# Altium schematic sheet OMD_30G_IMU.SchDoc
size A4; Organization: Altium Limited; Address1: L3, 12a Rodborough Rd; Address2: Frenchs Forest; Address3: NSW; Address4: Australia 2086
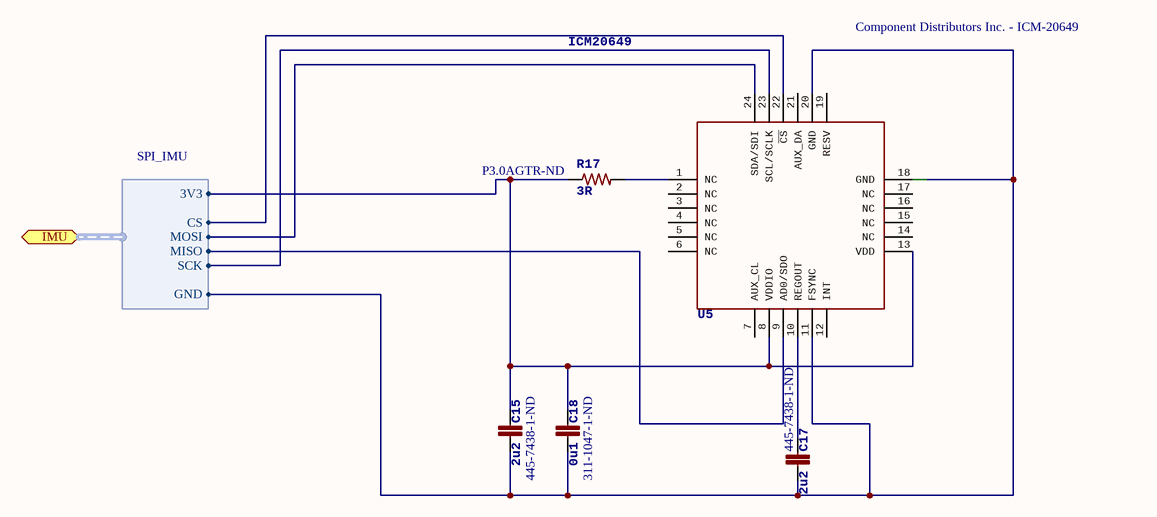
[diagram p0: OMD_30G_IMU.SchDoc]

## Parts
C15  2u2  Supplier Part Number 1: 445-7438-1-ND  [0603-CAP]
C17  2u2  Supplier Part Number 1: 445-7438-1-ND  [0603-CAP]
C18  0u1  Supplier Part Number 1: 311-1047-1-ND  [0402-CAP]
R17  3R  Supplier Part Number 1: P3.0AGTR-ND  [0201-RES]  (no BOM)
U5  ICM20649  Supplier Part Number 1: Component Distributors Inc. - ICM-20649  [ICM20649]

## Ports
IMU (harness SPI_IMU)

## Harnesses
SPI_IMU: SCK, MISO, MOSI, CS, 3V3, GND

## Nets
NetC15_1: C15.1 C18.P$1 R17.1 U5.8(VDDIO) U5.13(VDD) ; port IMU.3V3
NetC15_2: C15.2 C17.2 C18.P$2 U5.11(FSYNC) U5.18(GND) U5.20(GND) ; port IMU.GND
NetC17_1: C17.1 U5.10(REGOUT)
NetR17_2: R17.2 U5.1(NC)
NetU5_9: U5.9(AD0/SDO) ; port IMU.MISO
NetU5_22: U5.22(~{CS}) ; port IMU.CS
NetU5_23: U5.23(SCL/SCLK) ; port IMU.SCK
NetU5_24: U5.24(SDA/SDI) ; port IMU.MOSI

Not connected (* = marked no-connect by the designer): U5 2(NC) 3(NC) 4(NC) 5(NC) 6(NC) 7(AUX_CL) 12(INT) 14(NC) 15(NC) 16(NC) 17(NC) 19(RESV) 21(AUX_DA)

## Notes on the sheet
- https://github.com/OpenMotorDrive
- https://creativecommons.org/licenses/by-nc-sa/4.0/
- For Commercial use, please contact ProfiCNC
- Title
- Size:
- Date:
- A4
- Number:
- Time:
- Revision:
- Sheet
- of
- ProfiCNC Pty. Ltd.
- ProfiCNC does NOT guaranty these drawings as fit for any purpose, you must verify this information before attempting to use it in any way.  USE AT OWN RISK
- File:

## Library data of the parts
C15 C17 = CAP0603: CAP CER 2.2UF 16V 10% X6S 0603; Supplier 1: Digi-Key; Value: 2u2
C18 = CAP0402: CAP CER 0.1UF 16V Y5V 0402; Supplier 1: Digi-Key; Value: 0u1
R17 = RESISTOR0402-RES: RES 3OHM 1/16W 1% 0201 SMD; Supplier 1: Digi-Key
U5 = ICM20649: Supplier 1: Octopart